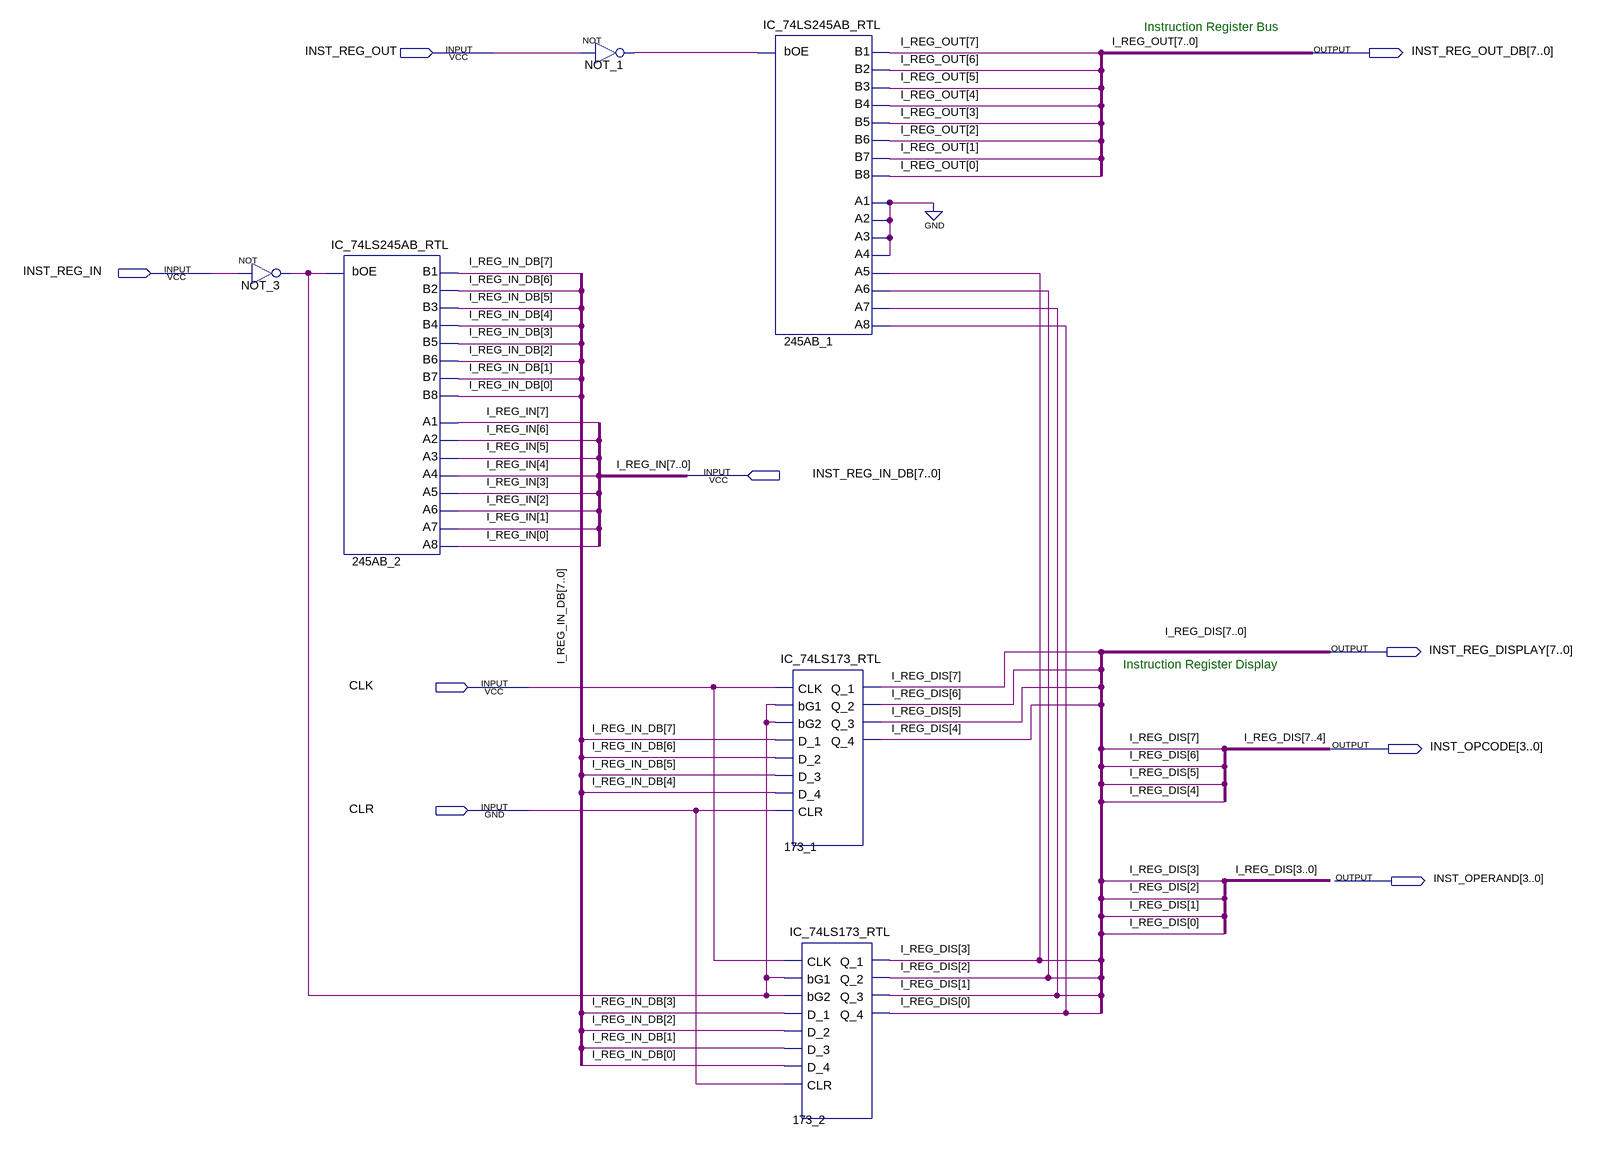
[diagram p0: schematic sheet]
// Quartus schematic Instruction_Register.bdf as structural Verilog: 6 symbols, 9 pins
module Instruction_Register (
  input  INST_REG_OUT,
  input  INST_REG_IN,
  input  [7:0] INST_REG_IN_DB,
  input  CLK,
  input  CLR,
  output [7:0] INST_REG_OUT_DB,
  output [7:0] INST_REG_DISPLAY,
  output [3:0] INST_OPCODE,
  output [3:0] INST_OPERAND
);

  wire NOT_1_out, NOT_3_out;
  wire [7:0] I_REG_IN_DB;

  not NOT_3 (NOT_3_out, INST_REG_IN);
  IC_74LS245AB_RTL u_245AB_2 (
    .bOE(NOT_3_out), .A1(INST_REG_IN_DB[7]), .A2(INST_REG_IN_DB[6]), .A3(INST_REG_IN_DB[5]),
    .A4(INST_REG_IN_DB[4]), .A5(INST_REG_IN_DB[3]), .A6(INST_REG_IN_DB[2]), .A7(INST_REG_IN_DB[1]),
    .A8(INST_REG_IN_DB[0]), .B1(I_REG_IN_DB[7]), .B2(I_REG_IN_DB[6]), .B3(I_REG_IN_DB[5]),
    .B4(I_REG_IN_DB[4]), .B5(I_REG_IN_DB[3]), .B6(I_REG_IN_DB[2]), .B7(I_REG_IN_DB[1]), .B8(I_REG_IN_DB[0]));
  not NOT_1 (NOT_1_out, INST_REG_OUT);
  IC_74LS245AB_RTL u_245AB_1 (
    .bOE(NOT_1_out), .A1(1'b0), .A2(1'b0), .A3(1'b0), .A4(1'b0), .A5(INST_OPERAND[3]), .A6(INST_OPERAND[2]),
    .A7(INST_OPERAND[1]), .A8(INST_OPERAND[0]), .B1(INST_REG_OUT_DB[7]), .B2(INST_REG_OUT_DB[6]),
    .B3(INST_REG_OUT_DB[5]), .B4(INST_REG_OUT_DB[4]), .B5(INST_REG_OUT_DB[3]), .B6(INST_REG_OUT_DB[2]),
    .B7(INST_REG_OUT_DB[1]), .B8(INST_REG_OUT_DB[0]));
  IC_74LS173_RTL u_173_1 (
    .CLK(CLK), .bG1(NOT_3_out), .bG2(NOT_3_out), .D_1(I_REG_IN_DB[7]), .D_2(I_REG_IN_DB[6]),
    .D_3(I_REG_IN_DB[5]), .D_4(I_REG_IN_DB[4]), .CLR(CLR), .Q_1(INST_OPCODE[3]), .Q_2(INST_OPCODE[2]),
    .Q_3(INST_OPCODE[1]), .Q_4(INST_OPCODE[0]));
  IC_74LS173_RTL u_173_2 (
    .CLK(CLK), .bG1(NOT_3_out), .bG2(NOT_3_out), .D_1(I_REG_IN_DB[3]), .D_2(I_REG_IN_DB[2]),
    .D_3(I_REG_IN_DB[1]), .D_4(I_REG_IN_DB[0]), .CLR(CLR), .Q_1(INST_OPERAND[3]), .Q_2(INST_OPERAND[2]),
    .Q_3(INST_OPERAND[1]), .Q_4(INST_OPERAND[0]));

  assign INST_REG_DISPLAY = {INST_OPCODE, INST_OPERAND};

  // Other names for the same wires on the sheet: I_REG_DIS[7:0] = {INST_OPCODE, INST_OPERAND};
  //   I_REG_IN[7:0] = INST_REG_IN_DB; I_REG_OUT[7:0] = INST_REG_OUT_DB

  // Notes on the sheet:
  //   Instruction Register Bus 
  //   Instruction Register Display 
endmodule
